# Altium schematic sheet Controller_Writting.SchDoc
size A3
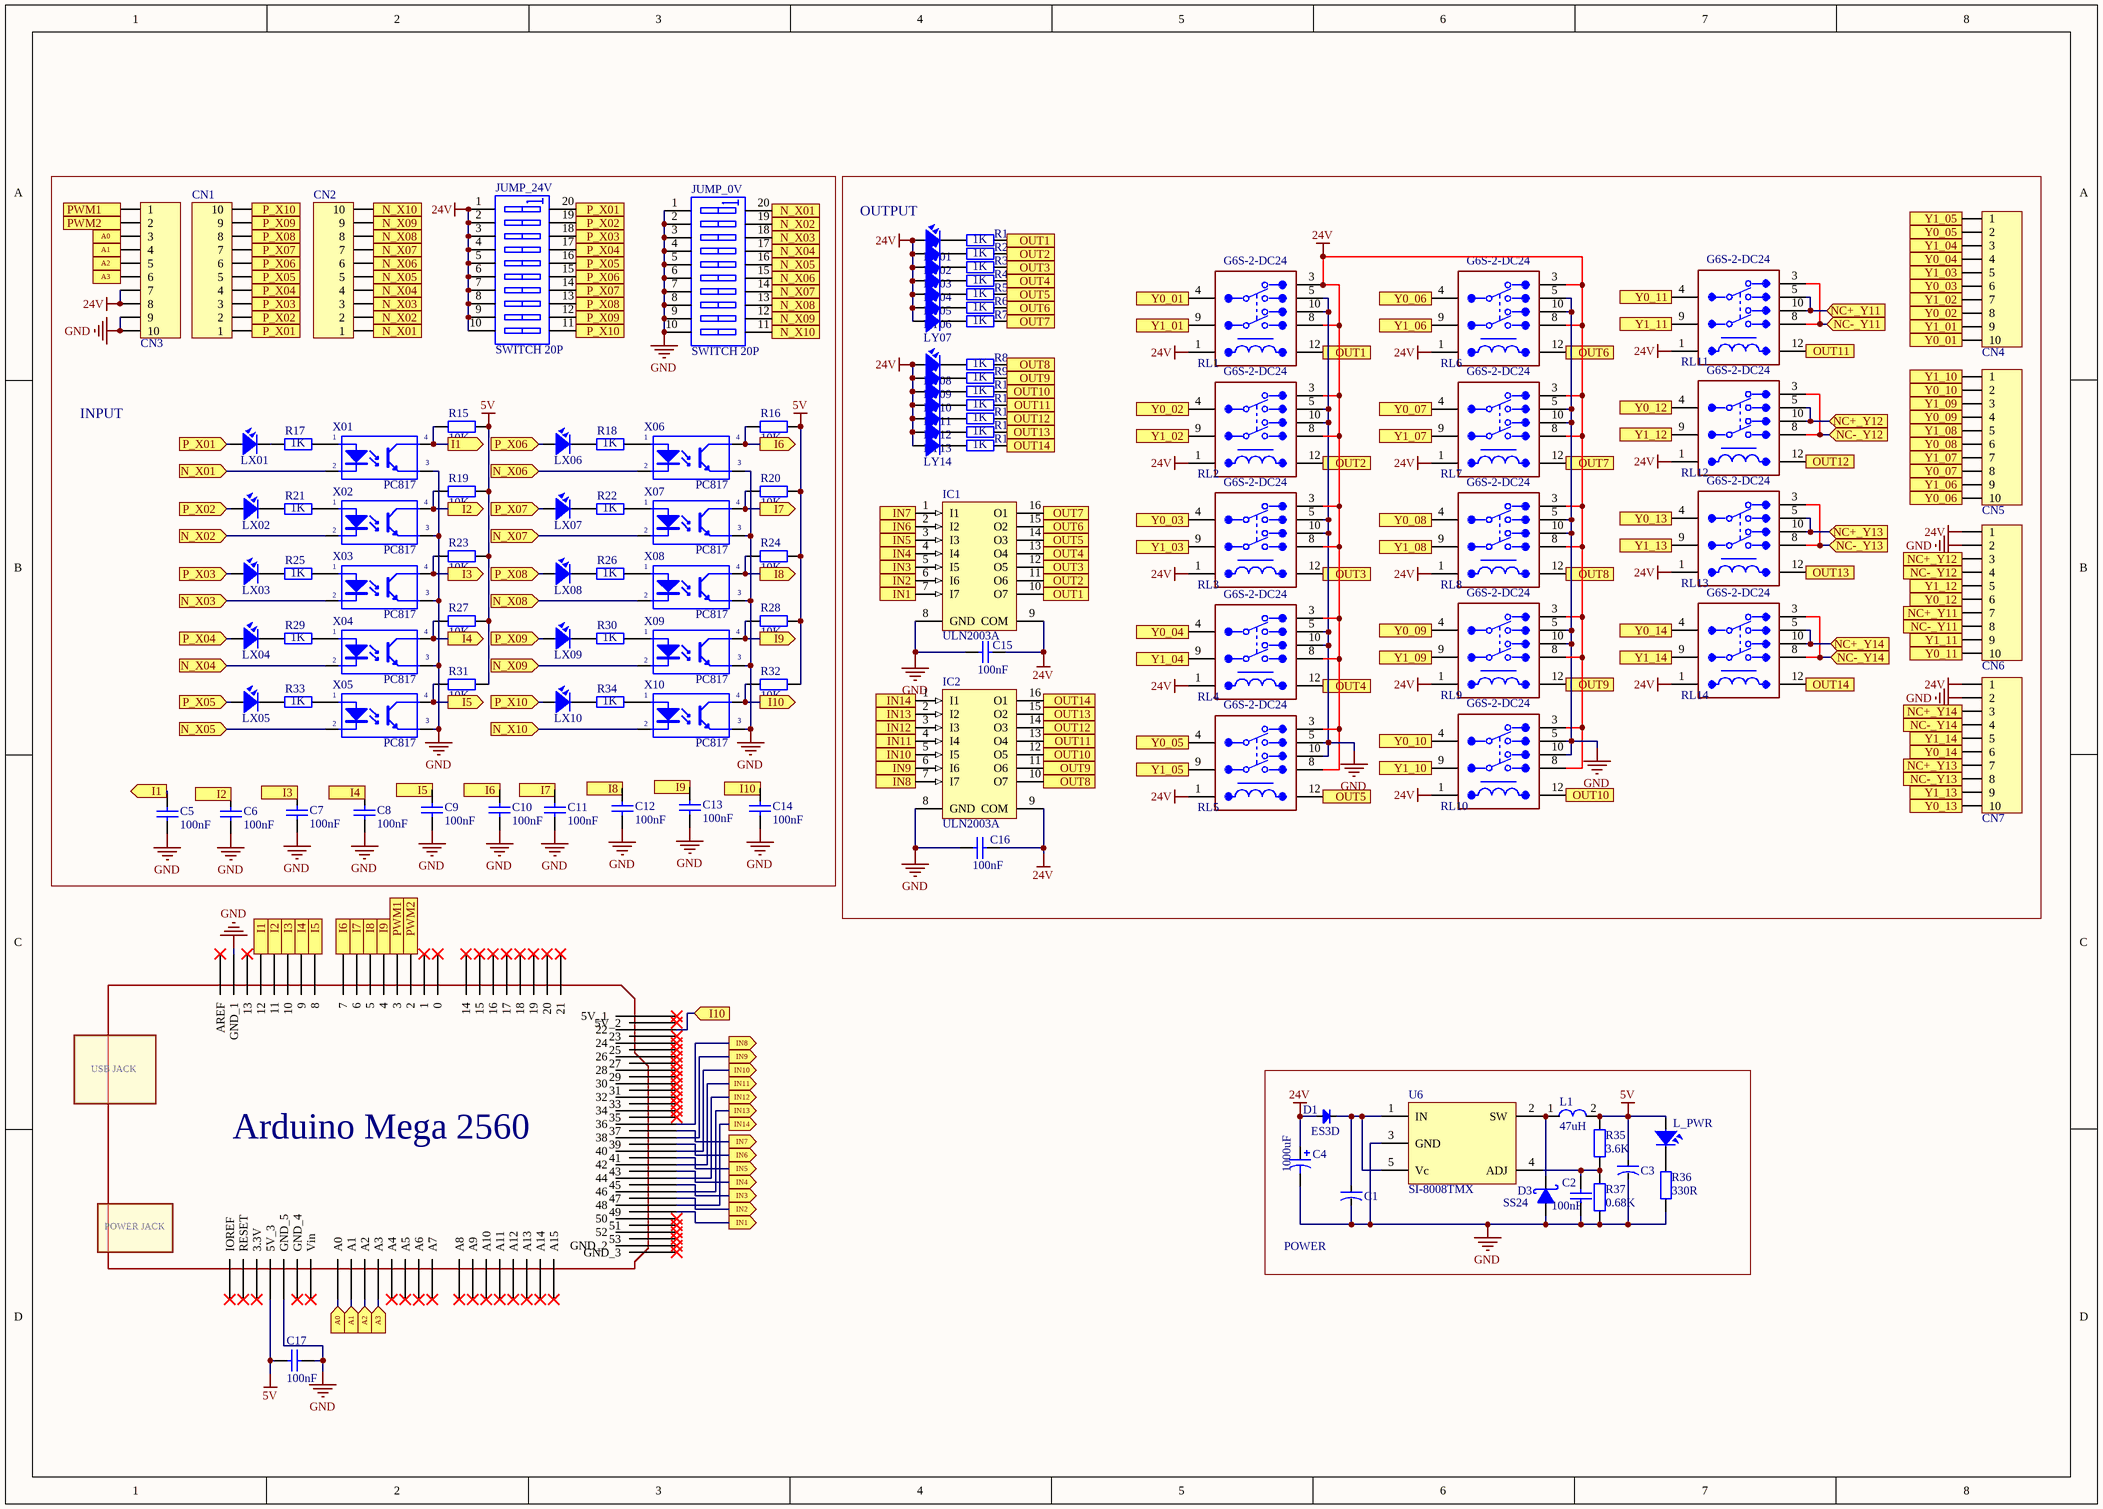
[diagram p0: Controller_Writting.SchDoc]

## Parts
C1  100uF  [CAP-ALU-SMD-pi10x10.5L]  (value not drawn)
C2  100nF  [CAP_0805]
C3  100uF  [CAP-ALU-SMD-pi10x10.5L]  (value not drawn)
C4  1000uF  [C10mm]
C5  100nF  [CAP_0805]
C6  100nF  [CAP_0805]
C7  100nF  [CAP_0805]
C8  100nF  [CAP_0805]
C9  100nF  [CAP_0805]
C10  100nF  [CAP_0805]
C11  100nF  [CAP_0805]
C12  100nF  [CAP_0805]
C13  100nF  [CAP_0805]
C14  100nF  [CAP_0805]
C15  100nF  [CAP_0805]
C16  100nF  [CAP_0805]
C17  100nF  [CAP_0805]
CN1  Terminal 20P  [Terminal KF142-5.08-10-R]  (value not drawn)
CN2  Terminal 20P  [Terminal KF142-5.08-10-R]  (value not drawn)
CN3  Terminal 20P  [Terminal KF142-5.08-10-R]  (value not drawn)
CN4  Terminal 20P  [Terminal KF142-5.08-10-R]  (value not drawn)
CN5  Terminal 20P  [Terminal KF142-5.08-10-R]  (value not drawn)
CN6  Terminal 20P  [Terminal KF142-5.08-10-R]  (value not drawn)
CN7  Terminal 20P  [Terminal KF142-5.08-10-R]  (value not drawn)
D1  ES3D  [DIO-SMD-214AB]
D3  SS24  [DIO-SMD-214AA]
IC1  ULN2003A  [SO-G16]
IC2  ULN2003A  [SO-G16]
JUMP_0V  SWITCH 20P  [DIP_SW_10]
JUMP_24V  SWITCH 20P  [DIP_SW_10]
L1  47uH  [L-SMD-M-12x10]
L_PWR  LED_BLUE  [LED-0805-Blue]  (value not drawn)
LX01  LED_RED  [LED-0805-Red]  (value not drawn)
LX02  LED_RED  [LED-0805-Red]  (value not drawn)
LX03  LED_RED  [LED-0805-Red]  (value not drawn)
LX04  LED_RED  [LED-0805-Red]  (value not drawn)
LX05  LED_RED  [LED-0805-Red]  (value not drawn)
LX06  LED_RED  [LED-0805-Red]  (value not drawn)
LX07  LED_RED  [LED-0805-Red]  (value not drawn)
LX08  LED_RED  [LED-0805-Red]  (value not drawn)
LX09  LED_RED  [LED-0805-Red]  (value not drawn)
LX10  LED_RED  [LED-0805-Red]  (value not drawn)
LY01  LED_BLUE  [LED-0805-Green]  (value not drawn)
LY02  LED_BLUE  [LED-0805-Green]  (value not drawn)
LY03  LED_BLUE  [LED-0805-Green]  (value not drawn)
LY04  LED_BLUE  [LED-0805-Green]  (value not drawn)
LY05  LED_BLUE  [LED-0805-Green]  (value not drawn)
LY06  LED_BLUE  [LED-0805-Green]  (value not drawn)
LY07  LED_BLUE  [LED-0805-Green]  (value not drawn)
LY08  LED_BLUE  [LED-0805-Green]  (value not drawn)
LY09  LED_BLUE  [LED-0805-Green]  (value not drawn)
LY10  LED_BLUE  [LED-0805-Green]  (value not drawn)
LY11  LED_BLUE  [LED-0805-Green]  (value not drawn)
LY12  LED_BLUE  [LED-0805-Green]  (value not drawn)
LY13  LED_BLUE  [LED-0805-Green]  (value not drawn)
LY14  LED_BLUE  [LED-0805-Green]  (value not drawn)
MEGA  Arduino  [ARDUINO_CUSTOM]  (value not drawn)
R1  1K  [DIEN TRO 2512]
R2  1K  [DIEN TRO 2512]
R3  1K  [DIEN TRO 2512]
R4  1K  [DIEN TRO 2512]
R5  1K  [DIEN TRO 2512]
R6  1K  [DIEN TRO 2512]
R7  1K  [DIEN TRO 2512]
R8  1K  [DIEN TRO 2512]
R9  1K  [DIEN TRO 2512]
R10  1K  [DIEN TRO 2512]
R11  1K  [DIEN TRO 2512]
R12  1K  [DIEN TRO 2512]
R13  1K  [DIEN TRO 2512]
R14  1K  [DIEN TRO 2512]
R15  10K  [RES-SMD-0805]
R16  10K  [RES-SMD-0805]
R17  1K  [RES-SMD-2512]
R18  1K  [RES-SMD-2512]
R19  10K  [RES-SMD-0805]
R20  10K  [RES-SMD-0805]
R21  1K  [RES-SMD-2512]
R22  1K  [RES-SMD-2512]
R23  10K  [RES-SMD-0805]
R24  10K  [RES-SMD-0805]
R25  1K  [RES-SMD-2512]
R26  1K  [RES-SMD-2512]
R27  10K  [RES-SMD-0805]
R28  10K  [RES-SMD-0805]
R29  1K  [RES-SMD-2512]
R30  1K  [RES-SMD-2512]
R31  10K  [RES-SMD-0805]
R32  10K  [RES-SMD-0805]
R33  1K  [RES-SMD-2512]
R34  1K  [RES-SMD-2512]
R35  3.6K  [RES-SMD-0603]
R36  330R  [RES-SMD-0805]
R37  value 0.68K  [RES-SMD-0603]  (hidden comment: 0.82K)
RL1  G6S-2-DC24  [Omron_GS6_2]
RL2  G6S-2-DC24  [Omron_GS6_2]
RL3  G6S-2-DC24  [Omron_GS6_2]
RL4  G6S-2-DC24  [Omron_GS6_2]
RL5  G6S-2-DC24  [Omron_GS6_2]
RL6  G6S-2-DC24  [Omron_GS6_2]
RL7  G6S-2-DC24  [Omron_GS6_2]
RL8  G6S-2-DC24  [Omron_GS6_2]
RL9  G6S-2-DC24  [Omron_GS6_2]
RL10  G6S-2-DC24  [Omron_GS6_2]
RL11  G6S-2-DC24  [Omron_GS6_2]
RL12  G6S-2-DC24  [Omron_GS6_2]
RL13  G6S-2-DC24  [Omron_GS6_2]
RL14  G6S-2-DC24  [Omron_GS6_2]
U6  SI-8008TMX  [TO252-5]
X01  PC817  [SOP-4]
X02  PC817  [SOP-4]
X03  PC817  [SOP-4]
X04  PC817  [SOP-4]
X05  PC817  [SOP-4]
X06  PC817  [SOP-4]
X07  PC817  [SOP-4]
X08  PC817  [SOP-4]
X09  PC817  [SOP-4]
X10  PC817  [SOP-4]

## Blocks framed on the sheet
INPUT: C5-C14 CN1-CN3 JUMP_0V JUMP_24V LX01 LX02 LX03 LX04 LX05 LX06 LX07 LX08 LX09 LX10 R15-R34 X01 X02 X03 X04 X05 X06 X07 X08 X09 X10
OUTPUT: C15 C16 CN4-CN7 IC1 IC2 LY01 LY02 LY03 LY04 LY05 LY06 LY07 LY08 LY09-LY14 R1-R14 RL1-RL14
POWER: C1-C4 D1 D3 L1 L_PWR R35-R37 U6

## Ports
A0 (in), A0 (out), A1 (in), A1 (out), A2 (in), A2 (out), A3 (in), A3 (out), I1 (in), I1 (out), I2 (in), I2 (out), I3 (in), I3 (out), I4 (in), I4 (out), I5 (in), I5 (out), I6 (in), I6 (out), I7 (in), I7 (out), I8 (in), I8 (out), I9 (in), I9 (out), I10 (in), I10 (out), IN1 (in), IN1 (out), IN2 (in), IN2 (out), IN3 (in), IN3 (out), IN4 (in), IN4 (out), IN5 (in), IN5 (out), IN6 (in), IN6 (out), IN7 (in), IN7 (out), IN8 (in), IN8 (out), IN9 (in), IN9 (out), IN10 (in), IN10 (out), IN11 (in), IN11 (out), IN12 (in), IN12 (out), IN13 (in), IN13 (out), IN14 (in), IN14 (out), N_X01 (in), N_X01 (out), N_X02 (in), N_X02 (out), N_X03 (in), N_X03 (out), N_X04 (in), N_X04 (out), N_X05 (in), N_X05 (out), N_X06 (in), N_X06 (out), N_X07 (in), N_X07 (out), N_X08 (in), N_X08 (out), N_X09 (in), N_X09 (out), N_X10 (in), N_X10 (out), NC+_Y11 (in), NC+_Y11 (out), NC+_Y12 (in), NC+_Y12 (out), NC+_Y13 (in), NC+_Y13 (out), NC+_Y14 (in), NC+_Y14 (out), NC-_Y11 (in), NC-_Y11 (out), NC-_Y12 (in), NC-_Y12 (out), NC-_Y13 (in), NC-_Y13 (out), NC-_Y14 (in), NC-_Y14 (out), OUT1 (out), OUT2 (out), OUT3 (out), OUT4 (out), OUT5 (out), OUT6 (out), OUT7 (out), OUT8 (out), OUT9 (out), OUT10 (out), OUT11 (out), OUT12 (out), OUT13 (out), OUT14 (out), P_X01 (in), P_X01 (out), P_X02 (in), P_X02 (out), P_X03 (in), P_X03 (out), P_X04 (in), P_X04 (out), P_X05 (in), P_X05 (out), P_X06 (in), P_X06 (out), P_X07 (in), P_X07 (out), P_X08 (in), P_X08 (out), P_X09 (in), P_X09 (out), P_X10 (in), P_X10 (out), PWM1 (in), PWM1 (out), PWM2 (in), PWM2 (out), Y0_01 (in), Y0_01 (out), Y0_02 (in), Y0_02 (out), Y0_03 (in), Y0_03 (out), Y0_04 (in), Y0_04 (out), Y0_05 (in), Y0_05 (out), Y0_06 (in), Y0_06 (out), Y0_07 (in), Y0_07 (out), Y0_08 (in), Y0_08 (out), Y0_09 (in), Y0_09 (out), Y0_10 (in), Y0_10 (out), Y0_11 (in), Y0_11 (out), Y0_12 (in), Y0_12 (out), Y0_13 (in), Y0_13 (out), Y0_14 (in), Y0_14 (out), Y1_01 (in), Y1_01 (out), Y1_02 (in), Y1_02 (out), Y1_03 (in), Y1_03 (out), Y1_04 (in), Y1_04 (out), Y1_05 (in), Y1_05 (out), Y1_06 (in), Y1_06 (out), Y1_07 (in), Y1_07 (out), Y1_08 (in), Y1_08 (out), Y1_09 (in), Y1_09 (out), Y1_10 (in), Y1_10 (out), Y1_11 (in), Y1_11 (out), Y1_12 (in), Y1_12 (out), Y1_13 (in), Y1_13 (out), Y1_14 (in), Y1_14 (out)

## Nets
5V: C3.1 C17.2 L1.2 L_PWR.1 MEGA.5V_3 R15.2 R16.2 R19.2 R20.2 R23.2 R24.2 R27.2 R28.2 R31.2 R32.2 R35.1
24V: C4.1 C15.1 C16.1 CN3.7 CN3.8 CN6.1 CN7.1 D1.1(A) IC1.9(COM) IC2.9(COM) JUMP_24V.1 JUMP_24V.2 JUMP_24V.3 JUMP_24V.4 JUMP_24V.5 JUMP_24V.6 JUMP_24V.7 JUMP_24V.8 JUMP_24V.9 JUMP_24V.10 LY01.1 LY02.1 LY03.1 LY04.1 LY05.1 LY06.1 LY07.1 LY08.1 LY09.1 LY10.1 LY11.1 LY12.1 LY13.1 LY14.1 RL1.1 RL1.3 RL1.8 RL2.1 RL2.3 RL2.8 RL3.1 RL3.3 RL3.8 RL4.1 RL4.3 RL4.8 RL5.1 RL5.3 RL5.8 RL6.1 RL6.3 RL6.8 RL7.1 RL7.3 RL7.8 RL8.1 RL8.3 RL8.8 RL9.1 RL9.3 RL9.8 RL10.1 RL10.3 RL10.8 RL11.1 RL12.1 RL13.1 RL14.1
GND: C1.2 C2.1 C3.2 C4.2 C5.1 C6.1 C7.1 C8.1 C9.1 C10.1 C11.1 C12.1 C13.1 C14.1 C15.2 C16.2 C17.1 CN3.9 CN3.10 CN6.2 CN7.2 D3.1(A) IC1.8(GND) IC2.8(GND) JUMP_0V.1 JUMP_0V.2 JUMP_0V.3 JUMP_0V.4 JUMP_0V.5 JUMP_0V.6 JUMP_0V.7 JUMP_0V.8 JUMP_0V.9 JUMP_0V.10 MEGA.GND_1 MEGA.GND_5 R36.2 R37.2 RL1.5 RL1.10 RL2.5 RL2.10 RL3.5 RL3.10 RL4.5 RL4.10 RL5.5 RL5.10 RL6.5 RL6.10 RL7.5 RL7.10 RL8.5 RL8.10 RL9.5 RL9.10 RL10.5 RL10.10 U6.3(GND) X01.3(E) X02.3(E) X03.3(E) X04.3(E) X05.3(E) X06.3(E) X07.3(E) X08.3(E) X09.3(E) X10.3(E)
A0: CN3.3 MEGA.A0 ; port A0
A1: CN3.4 MEGA.A1 ; port A1
A2: CN3.5 MEGA.A2 ; port A2
A3: CN3.6 MEGA.A3 ; port A3
I1: C5.2 MEGA.12 R15.1 X01.4(C) ; port I1
I2: C6.2 MEGA.11 R19.1 X02.4(C) ; port I2
I3: C7.2 MEGA.10 R23.1 X03.4(C) ; port I3
I4: C8.2 MEGA.9 R27.1 X04.4(C) ; port I4
I5: C9.2 MEGA.8 R31.1 X05.4(C) ; port I5
I6: C10.2 MEGA.7 R16.1 X06.4(C) ; port I6
I7: C11.2 MEGA.6 R20.1 X07.4(C) ; port I7
I8: C12.2 MEGA.5 R24.1 X08.4(C) ; port I8
I9: C13.2 MEGA.4 R28.1 X09.4(C) ; port I9
I10: C14.2 MEGA.22 R32.1 X10.4(C) ; port I10
IN1: IC1.7(I7) MEGA.49 ; port IN1
IN2: IC1.6(I6) MEGA.47 ; port IN2
IN3: IC1.5(I5) MEGA.45 ; port IN3
IN4: IC1.4(I4) MEGA.43 ; port IN4
IN5: IC1.3(I3) MEGA.41 ; port IN5
IN6: IC1.2(I2) MEGA.39 ; port IN6
IN7: IC1.1(I1) MEGA.37 ; port IN7
IN8: IC2.7(I7) MEGA.36 ; port IN8
IN9: IC2.6(I6) MEGA.38 ; port IN9
IN10: IC2.5(I5) MEGA.40 ; port IN10
IN11: IC2.4(I4) MEGA.42 ; port IN11
IN12: IC2.3(I3) MEGA.44 ; port IN12
IN13: IC2.2(I2) MEGA.46 ; port IN13
IN14: IC2.1(I1) MEGA.48 ; port IN14
N_X01: CN2.1 JUMP_0V.20 X01.2(K) ; port N_X01
N_X02: CN2.2 JUMP_0V.19 X02.2(K) ; port N_X02
N_X03: CN2.3 JUMP_0V.18 X03.2(K) ; port N_X03
N_X04: CN2.4 JUMP_0V.17 X04.2(K) ; port N_X04
N_X05: CN2.5 JUMP_0V.16 X05.2(K) ; port N_X05
N_X06: CN2.6 JUMP_0V.15 X06.2(K) ; port N_X06
N_X07: CN2.7 JUMP_0V.14 X07.2(K) ; port N_X07
N_X08: CN2.8 JUMP_0V.13 X08.2(K) ; port N_X08
N_X09: CN2.9 JUMP_0V.12 X09.2(K) ; port N_X09
N_X10: CN2.10 JUMP_0V.11 X10.2(K) ; port N_X10
NC+_Y11: CN6.7 RL11.5 RL11.10 ; port NC+_Y11
NC+_Y12: CN6.3 RL12.5 RL12.10 ; port NC+_Y12
NC+_Y13: CN7.7 RL13.5 RL13.10 ; port NC+_Y13
NC+_Y14: CN7.3 RL14.5 RL14.10 ; port NC+_Y14
NC-_Y11: CN6.8 RL11.3 RL11.8 ; port NC-_Y11
NC-_Y12: CN6.4 RL12.3 RL12.8 ; port NC-_Y12
NC-_Y13: CN7.8 RL13.3 RL13.8 ; port NC-_Y13
NC-_Y14: CN7.4 RL14.3 RL14.8 ; port NC-_Y14
OUT1: IC1.10(O7) R1.2 RL1.12 ; port OUT1
OUT2: IC1.11(O6) R2.2 RL2.12 ; port OUT2
OUT3: IC1.12(O5) R3.2 RL3.12 ; port OUT3
OUT4: IC1.13(O4) R4.2 RL4.12 ; port OUT4
OUT5: IC1.14(O3) R5.2 RL5.12 ; port OUT5
OUT6: IC1.15(O2) R6.2 RL6.12 ; port OUT6
OUT7: IC1.16(O1) R7.2 RL7.12 ; port OUT7
OUT8: IC2.10(O7) R8.2 RL8.12 ; port OUT8
OUT9: IC2.11(O6) R9.2 RL9.12 ; port OUT9
OUT10: IC2.12(O5) R10.2 RL10.12 ; port OUT10
OUT11: IC2.13(O4) R11.2 RL11.12 ; port OUT11
OUT12: IC2.14(O3) R12.2 RL12.12 ; port OUT12
OUT13: IC2.15(O2) R13.2 RL13.12 ; port OUT13
OUT14: IC2.16(O1) R14.2 RL14.12 ; port OUT14
P_X01: CN1.1 JUMP_24V.20 LX01.1 ; port P_X01
P_X02: CN1.2 JUMP_24V.19 LX02.1 ; port P_X02
P_X03: CN1.3 JUMP_24V.18 LX03.1 ; port P_X03
P_X04: CN1.4 JUMP_24V.17 LX04.1 ; port P_X04
P_X05: CN1.5 JUMP_24V.16 LX05.1 ; port P_X05
P_X06: CN1.6 JUMP_24V.15 LX06.1 ; port P_X06
P_X07: CN1.7 JUMP_24V.14 LX07.1 ; port P_X07
P_X08: CN1.8 JUMP_24V.13 LX08.1 ; port P_X08
P_X09: CN1.9 JUMP_24V.12 LX09.1 ; port P_X09
P_X10: CN1.10 JUMP_24V.11 LX10.1 ; port P_X10
PWM1: CN3.1 MEGA.3 ; port PWM1
PWM2: CN3.2 MEGA.2 ; port PWM2
Y0_01: CN4.10 RL1.4 ; port Y0_01
Y0_02: CN4.8 RL2.4 ; port Y0_02
Y0_03: CN4.6 RL3.4 ; port Y0_03
Y0_04: CN4.4 RL4.4 ; port Y0_04
Y0_05: CN4.2 RL5.4 ; port Y0_05
Y0_06: CN5.10 RL6.4 ; port Y0_06
Y0_07: CN5.8 RL7.4 ; port Y0_07
Y0_08: CN5.6 RL8.4 ; port Y0_08
Y0_09: CN5.4 RL9.4 ; port Y0_09
Y0_10: CN5.2 RL10.4 ; port Y0_10
Y0_11: CN6.10 RL11.4 ; port Y0_11
Y0_12: CN6.6 RL12.4 ; port Y0_12
Y0_13: CN7.10 RL13.4 ; port Y0_13
Y0_14: CN7.6 RL14.4 ; port Y0_14
Y1_01: CN4.9 RL1.9 ; port Y1_01
Y1_02: CN4.7 RL2.9 ; port Y1_02
Y1_03: CN4.5 RL3.9 ; port Y1_03
Y1_04: CN4.3 RL4.9 ; port Y1_04
Y1_05: CN4.1 RL5.9 ; port Y1_05
Y1_06: CN5.9 RL6.9 ; port Y1_06
Y1_07: CN5.7 RL7.9 ; port Y1_07
Y1_08: CN5.5 RL8.9 ; port Y1_08
Y1_09: CN5.3 RL9.9 ; port Y1_09
Y1_10: CN5.1 RL10.9 ; port Y1_10
Y1_11: CN6.9 RL11.9 ; port Y1_11
Y1_12: CN6.5 RL12.9 ; port Y1_12
Y1_13: CN7.9 RL13.9 ; port Y1_13
Y1_14: CN7.5 RL14.9 ; port Y1_14
NetC1_1: C1.1 D1.2(K) U6.1(IN) U6.5(Vc)
NetC2_2: C2.2 R35.2 R37.1 U6.4(ADJ)
NetD3_2: D3.2(K) L1.1 U6.2(SW)
NetL_PWR_2: L_PWR.2 R36.1
NetLX01_2: LX01.2 R17.1
NetLX02_2: LX02.2 R21.1
NetLX03_2: LX03.2 R25.1
NetLX04_2: LX04.2 R29.1
NetLX05_2: LX05.2 R33.1
NetLX06_2: LX06.2 R18.1
NetLX07_2: LX07.2 R22.1
NetLX08_2: LX08.2 R26.1
NetLX09_2: LX09.2 R30.1
NetLX10_2: LX10.2 R34.1
NetLY01_2: LY01.2 R1.1
NetLY02_2: LY02.2 R2.1
NetLY03_2: LY03.2 R3.1
NetLY04_2: LY04.2 R4.1
NetLY05_2: LY05.2 R5.1
NetLY06_2: LY06.2 R6.1
NetLY07_2: LY07.2 R7.1
NetLY08_2: LY08.2 R8.1
NetLY09_2: LY09.2 R9.1
NetLY10_2: LY10.2 R10.1
NetLY11_2: LY11.2 R11.1
NetLY12_2: LY12.2 R12.1
NetLY13_2: LY13.2 R13.1
NetLY14_2: LY14.2 R14.1
NetR17_2: R17.2 X01.1(A)
NetR18_2: R18.2 X06.1(A)
NetR21_2: R21.2 X02.1(A)
NetR22_2: R22.2 X07.1(A)
NetR25_2: R25.2 X03.1(A)
NetR26_2: R26.2 X08.1(A)
NetR29_2: R29.2 X04.1(A)
NetR30_2: R30.2 X09.1(A)
NetR33_2: R33.2 X05.1(A)
NetR34_2: R34.2 X10.1(A)

Not connected (* = marked no-connect by the designer): MEGA 0* 1* 3.3V* 5V_1* 5V_2* 13* 14* 15* 16* 17* 18* 19* 20* 21* 23* 24* 25* 26* 27* 28* 29* 30* 31* 32* 33* 34* 35* 50* 51* 52* 53* A4* A5* A6* A7* A8* A9* A10* A11* A12* A13* A14* A15* AREF* GND_2* GND_3* GND_4* IOREF* RESET* Vin*

## Notes on the sheet
- (in symbol ArduinoMega2560) USB JACK; Arduino Mega 2560; POWER JACK

## Library data of the parts
C1 C3 = CN-ALU-SMD: ALU Capacitor, 50V,10x10.3mm; Published: 8-Jun-2000; LatestRevisionDate: 17-Jul-2002; LatestRevisionNote: Re-released for DXP Platform.; PackageReference: POLAR0.8; Publisher: Altium Limited
C2 C5-C17 = CapCeramic: Capacitor Ceramic 0805, 50V; Published: 8-Jun-2000; LatestRevisionDate: 17-Jul-2002; LatestRevisionNote: Re-released for DXP Platform.; PackageReference: RAD-0.3; Publisher: Altium Limited; Value: 100nF
C4 = Cap Pol 12mm: Capacitor Electric 12mm, 35V; Published: 8-Jun-2000; LatestRevisionDate: 17-Jul-2002; LatestRevisionNote: Re-released for DXP Platform.; PackageReference: POLAR0.8; Publisher: Altium Limited
CN1-CN7 = Terminal KF142-5.08-10-R
D1 = Diode SMD: Diode Rectifier, 200V/3A, DO-214AB; Code - JEDEC: DO-214-AB; Value: ES3D; Published: 8-Jun-2000; Revision: July-2002: Re-released for DXP Platform.; Publisher: Altium Limited
D3 = 1N5822: Schottky Rectifiers, 40V/2A, DO-214AA; Value: Diode c?m 1N5408
IC1 IC2 = ULN2003A: High-Current Darlington Array, SO16; LatestRevisionNote: Stylized 3D Model Added.; Publisher: Altium Limited; Value: ULN2003A
JUMP_0V JUMP_24V = SWDIP10: SWITCH 5.08mm; Manufacturer: Wurth Elektronik; Part No.: 418127160910; ComponentLink1 Description: Manufacturer; ComponentLink2 Description: Datasheet; Pole: 10; Created Date: Dec.2015; ComponentLink1URL: http://www.we-online.com; ComponentLink2URL: http://katalog.we-online.de/em/datasheet/4181271609xx.pdf; Created by: Baojun Chen
L1 = L-SMD-1: Inductor 12x12; partNo: 78477010; Manufacturer: Wurth Elektronik; Inductance: 1.0 μH; ComponentLink1Description: Manufacturer; ComponentLink1URL: http://www.we-online.de; Created by: Baojun Chen; Created Date: Nov.2015; ComponentLink2Description: Datasheet; ComponentLink2URL: http://katalog.we-online.de/pbs/datasheet/78477010.pdf
L_PWR LY01 LY02 LY03 LY04 LY05 LY06 LY07 LY08 LY09-LY14 = LED SMD: LED BLUE 0805; Value: LED 3 - 5 ly 2 Colour
LX01 LX02 LX03 LX04 LX05 LX06 LX07 LX08 LX09 LX10 = LED SMD: LED RED 0805; Value: LED 3 - 5 ly 2 Colour
MEGA = ArduinoMega2560: Mega 2560 Kit; GateName_1: G$1; SymbolName_1: MEGA_SYMBOL; DeviceSetName: MEGA_DEVICE; LibraryName: ArduinoMegaOutline; Package: MEGAOUTLINE
R1-R14 R17 R18 R21 R22 R25 R26 R29 R30 R33 R34 = R2512: Resistor SMD 2512, 1W
R15 R16 R19 R20 R23 R24 R27 R28 R31 R32 R36 = R0805: Resistor SMD 0805, 1/8W; Published: 8-Jun-2000; LatestRevisionDate: 17-Jul-2002; LatestRevisionNote: Re-released for DXP Platform.; PackageReference: AXIAL-0.4; Publisher: Altium Limited
  R15 R16 R19 R20 R23 R24 R27 R28 R31 R32: Value: 10K
  R36: Value: 330R
R35 R37 = R0805: Resistor SMD 0603, 1/10W; Published: 8-Jun-2000; LatestRevisionDate: 17-Jul-2002; LatestRevisionNote: Re-released for DXP Platform.; PackageReference: AXIAL-0.4; Publisher: Altium Limited
  R35: Value: 3.6K
RL1-RL14 = G6S-2-DC24: Relay dual 24VDC Omron
U6 = SI-8008TMX: Buck Switching Regulator IC, TO252-5
X01 X02 X03 X04 X05 X06 X07 X08 X09 X10 = PC817: Single Opto, SOP-4; Value: PC817